# EAGLE schematic main_board_updated (EAGLE 8.2.2)
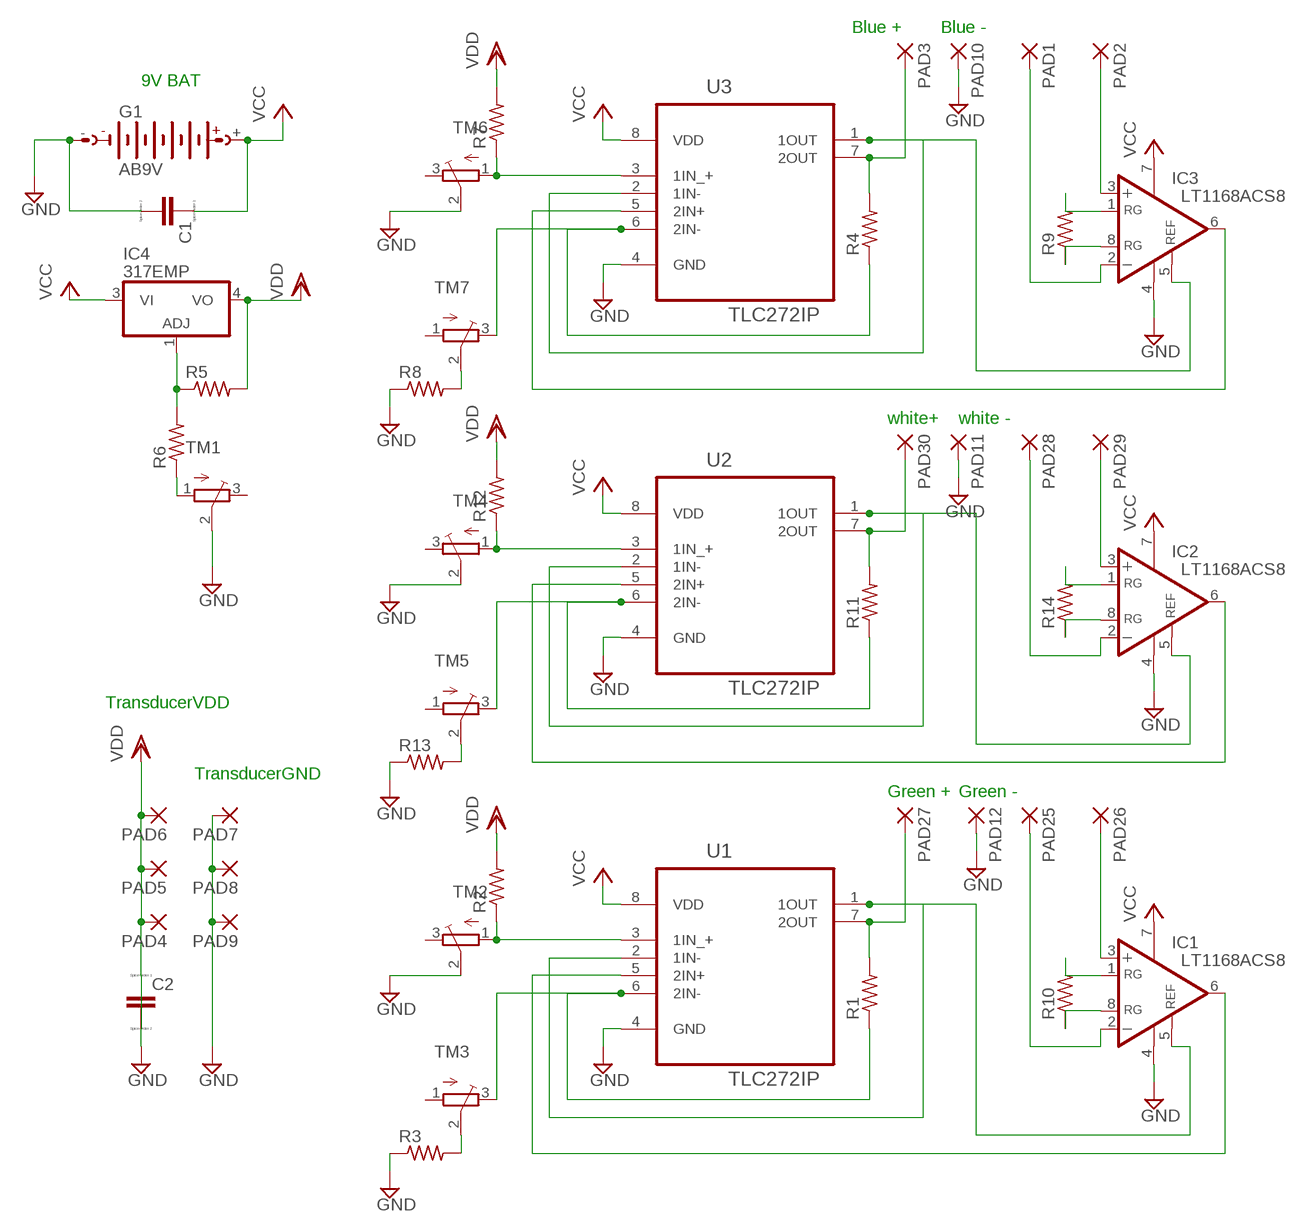
[diagram p0: schematic, sheet 1]

## Parts
C1  CC2012  [C2012]
C2  CC2012  [C2012]
G1  AB9V  [AB9V]
IC1  LT1168ACS8  [SOIC8]
IC2  LT1168ACS8  [SOIC8]
IC3  LT1168ACS8  [SOIC8]
IC4  317EMP  [SOT223]
PAD1  1,6/0,9  [1,6/0,9]
PAD2  1,6/0,9  [1,6/0,9]
PAD3  1,6/0,9  [1,6/0,9]
PAD4  1,6/0,9  [1,6/0,9]
PAD5  1,6/0,9  [1,6/0,9]
PAD6  1,6/0,9  [1,6/0,9]
PAD7  1,6/0,9  [1,6/0,9]
PAD8  1,6/0,9  [1,6/0,9]
PAD9  1,6/0,9  [1,6/0,9]
PAD10  1,6/0,9  [1,6/0,9]
PAD11  1,6/0,9  [1,6/0,9]
PAD12  1,6/0,9  [1,6/0,9]
PAD25  1,6/0,9  [1,6/0,9]
PAD26  1,6/0,9  [1,6/0,9]
PAD27  1,6/0,9  [1,6/0,9]
PAD28  1,6/0,9  [1,6/0,9]
PAD29  1,6/0,9  [1,6/0,9]
PAD30  1,6/0,9  [1,6/0,9]
R1  R-US_R1206  [R1206]
R2  R-US_R1206  [R1206]
R3  R-US_R1206  [R1206]
R4  R-US_R1206  [R1206]
R5  R-US_R1206  [R1206]
R6  R-US_R1206  [R1206]
R7  R-US_R1206  [R1206]
R8  R-US_R1206  [R1206]
R9  R-US_R1206  [R1206]
R10  R-US_R1206  [R1206]
R11  R-US_R1206  [R1206]
R12  R-US_R1206  [R1206]
R13  R-US_R1206  [R1206]
R14  R-US_R1206  [R1206]
TM1  TRIMPOT3386  [TRIM-3386]
TM2  TRIMPOT3386  [TRIM-3386]
TM3  TRIMPOT3386  [TRIM-3386]
TM4  TRIMPOT3386  [TRIM-3386]
TM5  TRIMPOT3386  [TRIM-3386]
TM6  TRIMPOT3386  [TRIM-3386]
TM7  TRIMPOT3386  [TRIM-3386]
U1  TLC272IP  [DIP254P762X508-8]
U2  TLC272IP  [DIP254P762X508-8]
U3  TLC272IP  [DIP254P762X508-8]

## Nets
GND: C1.2 C2.2 G1.- IC1.4(V-) IC2.4(V-) IC3.4(V-) PAD7.1(P) PAD8.1(P) PAD9.1(P) PAD10.1(P) PAD11.1(P) PAD12.1(P) R3.1 R8.1 R13.1 TM1.2(S) TM2.2(S) TM4.2(S) TM6.2(S) U1.4(GND) U2.4(GND) U3.4(GND)
N$1: PAD27.1(P) R1.2 U1.7(2OUT)
N$2: R1.1 TM3.3(E) U1.6(2IN-)
N$3: R2.1 TM2.1(A) U1.3(1IN_+)
N$4: IC1.5(REF) U1.1(1OUT) U1.2(1IN-)
N$5: R3.2 TM3.2(S)
N$6: IC4.1(ADJ) R5.1 R6.2
N$7: PAD3.1(P) R4.2 U3.7(2OUT)
N$8: R4.1 TM7.3(E) U3.6(2IN-)
N$9: IC3.5(REF) U3.1(1OUT) U3.2(1IN-)
N$10: R6.1 TM1.1(A)
N$11: R7.1 TM6.1(A) U3.3(1IN_+)
N$12: IC3.1(RG) R9.2
N$13: R8.2 TM7.2(S)
N$14: IC3.8(RG) R9.1
N$15: IC3.6(OUT) U3.5(2IN+)
N$16: IC1.1(RG) R10.2
N$17: IC3.3(+IN) PAD2.1(P)
N$18: IC3.2(-IN) PAD1.1(P)
N$19: IC1.8(RG) R10.1
N$20: IC1.6(OUT) U1.5(2IN+)
N$21: IC1.3(+IN) PAD26.1(P)
N$22: IC1.2(-IN) PAD25.1(P)
N$23: PAD30.1(P) R11.2 U2.7(2OUT)
N$24: R11.1 TM5.3(E) U2.6(2IN-)
N$25: R12.1 TM4.1(A) U2.3(1IN_+)
N$26: IC2.5(REF) U2.1(1OUT) U2.2(1IN-)
N$27: R13.2 TM5.2(S)
N$28: IC2.1(RG) R14.2
N$29: IC2.8(RG) R14.1
N$30: IC2.6(OUT) U2.5(2IN+)
N$31: IC2.3(+IN) PAD29.1(P)
N$32: IC2.2(-IN) PAD28.1(P)
VCC: C1.1 G1.+ IC1.7(V+) IC2.7(V+) IC3.7(V+) IC4.3(VI) U1.8(VDD) U2.8(VDD) U3.8(VDD)
VDD: C2.1 IC4.4(VO) PAD4.1(P) PAD5.1(P) PAD6.1(P) R2.2 R5.2 R7.2 R12.2
Unconnected: TM1.3(E) TM2.3(E) TM3.1(A) TM4.3(E) TM5.1(A) TM6.3(E) TM7.1(A)

## Notes on the sheet
- Blue + | Blue -
- 9V BAT
- white+ | white -
- TransducerVDD
- TransducerGND
- Green + | Green -

## Library data of the parts
C1 C2 = eagle-ltspice:C: CAPACITOR, European symbol; SPICEMODEL: NONE; SPICEPREFIX: C
G1 = battery:AB9V: 9-V BATTERY CLIP
IC1-IC3 = linear-technology:LT1168: Low Power, Single Resistor Gain Programmable, Precision Instrumentation Amplifier SourcE: LT1168.pdf; MPN: LT1168ACS8; OC_FARNELL: unknown; OC_NEWARK: 57M2316
IC4 = linear:*317: Positive VOLTAGE REGULATOR
PAD1-PAD12 PAD25-PAD30 = wirepad:1,6/0,9: THROUGH-HOLE PAD
R1-R14 = adafruit:R-US_: RESISTOR, American symbol
TM1-TM7 = adafruit:TRIMPOT: SMT trimmer potentiometer part number TC33X http://www.ladyada.net/library/eagle
U1-U3 = Texas Instruments_By_element14_Batch_1:TLC272IP: OPERATIONAL AMPLIFIER; MPN: TLC272IP; OC_FARNELL: 2386835; OC_NEWARK: 08F9090; PACKAGE: PDIP; SUPPLIER: Texas Instruments